# Altium project Ctrlboard.PrjPCB
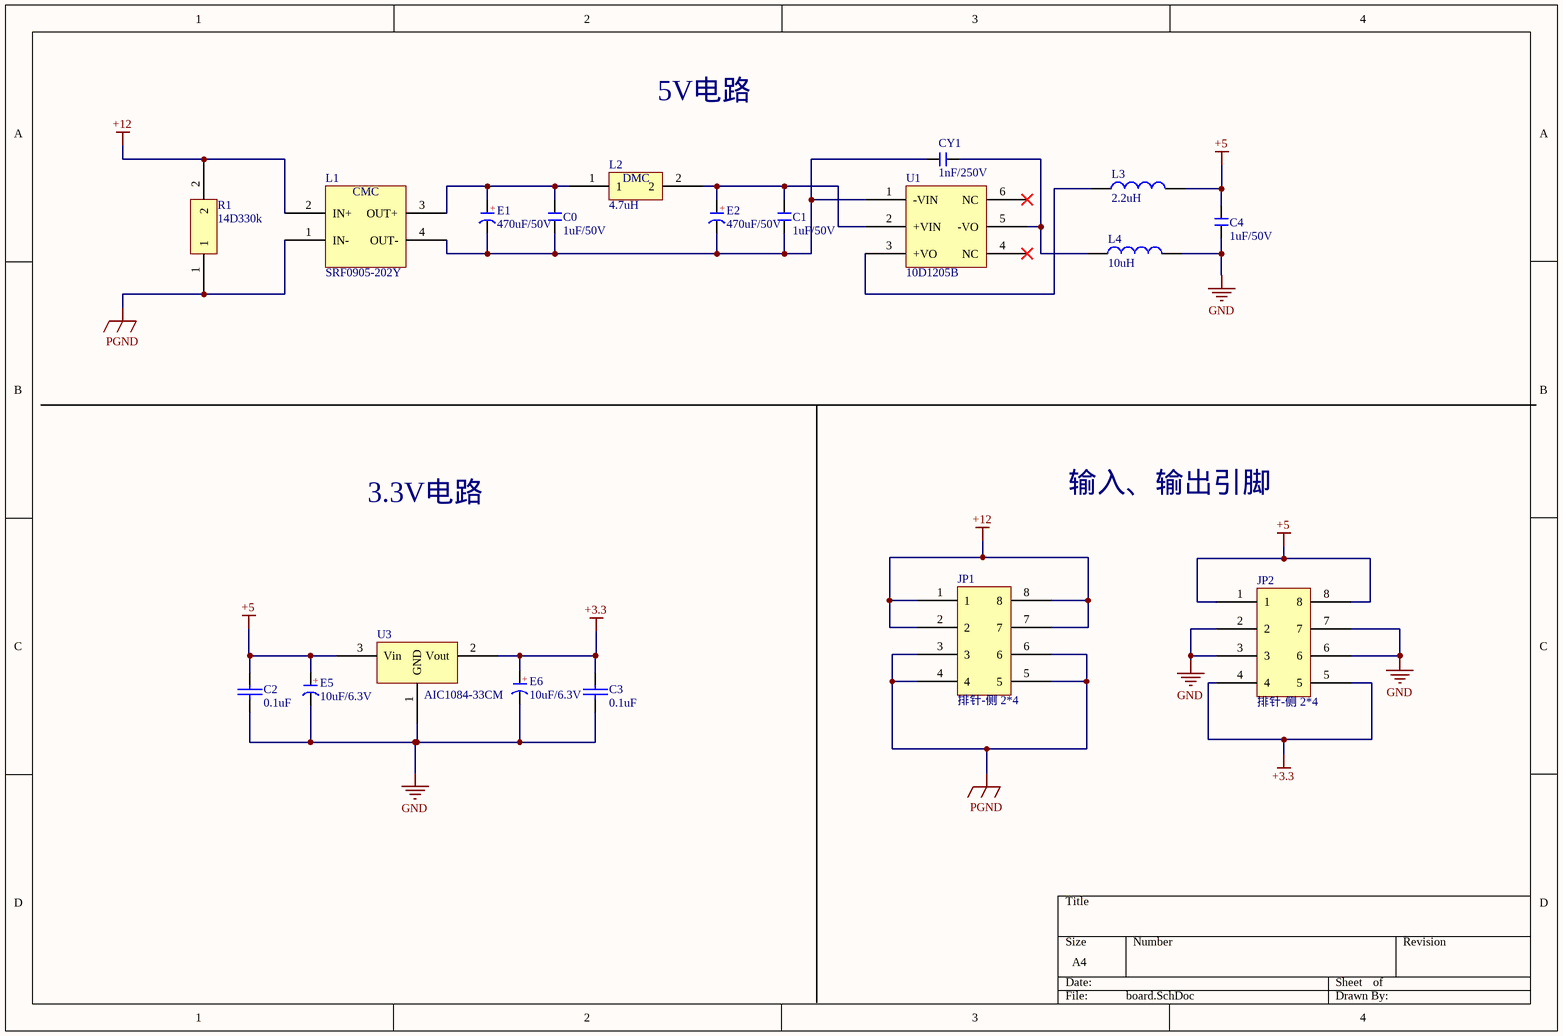
[diagram p0: board.SchDoc]
1 sheet, 19 parts. Net scope: global (net labels, ports and power ports of the same name join across sheets).
Board file: s_pboard2.PcbDoc

## Sheet board.SchDoc
size A4

### Parts
C0  1uF/50V  [CC 2.2*5]
C1  1uF/50V  [CC 2.2*5]
C2  0.1uF  [0603C]
C3  0.1uF  [0603C]
C4  1uF/50V  [CC 2.2*5]
CY1  1nF/250V  [CY 7.5*10*4]
E1  470uF/50V  [CM G(12.5*13.5)]
E2  470uF/50V  [CM G(12.5*13.5)]
E5  10uF/6.3V  [CD A(3216)]
E6  10uF/6.3V  [CD A(3216)]
JP1  排针-侧 2*4  [排针-侧 2*4]
JP2  排针-侧 2*4  [排针-侧 2*4]
L1  SRF0905-202Y  [SRF0905]
L2  4.7uH  [NR5020]
L3  2.2uH  [L 0805]
L4  10uH  [L 0805]
R1  14D330k  [14D330k]
U1  10D1205B  [10D1205B]
U3  AIC1084-33CM  [TO263-3B]

### Nets
+3.3: C3.1 E6.1(A) JP2.4 JP2.5 U3.2(Vout)
+5: C2.2 C4.1 E5.1(A) JP2.1 JP2.8 L3.2 U3.3(Vin)
+12: JP1.1 JP1.2 JP1.7 JP1.8 L1.2(IN+) R1.2
GND: C2.1 C3.2 C4.2 E5.2(K) E6.2(K) JP2.2 JP2.3 JP2.6 JP2.7 L4.2 U3.1(GND)
PGND: JP1.3 JP1.4 JP1.5 JP1.6 L1.1(IN-) R1.1
NetC0_1: C0.1 E1.1(A) L1.3(OUT+) L2.1
NetC0_2: C0.2 C1.2 CY1.1 E1.2(K) E2.2(K) L1.4(OUT-) U1.1(-VIN)
NetC1_1: C1.1 E2.1(A) L2.2 U1.2(+VIN)
NetCY1_2: CY1.2 L4.1 U1.5(-VO)
NetL3_1: L3.1 U1.3(+VO)

Not connected (* = marked no-connect by the designer): U1 4(NC)* 6(NC)*

### Notes on the sheet
- 5V电路
- 3.3V电路
- 输入、输出引脚
- (in symbol C-CD) +
- (in symbol C-CM) +
- (in symbol DML-5020) DMC
- (in symbol SRF0905-202Y) CMC

### Library data of the parts
C0 C1 C4 = C-CC: 直插瓷片电容; 版权归属: 源创客; BOM名称: 直插瓷片电容; 学习资源: www.ooocke.com
C2 C3 = CAP: 无极性电容
CY1 = C-CY: 高压陶瓷电容，Y电容; 版权归属: 源创客; BOM名称: 高压陶瓷电容，Y电容; 学习资源: www.ooocke.com
E1 E2 = C-CM: 贴片电解电容; 版权归属: 源创客; BOM名称: 贴片电解电容; 学习资源: www.ooocke.com
E5 E6 = C-CD: 贴片钽电容; 版权归属: 源创客; BOM名称: 贴片钽电容; 学习资源: www.ooocke.com
L1 = SRF0905-202Y: 共模电感
L2 = DML-5020: 差模电感
L3 L4 = L: 小功率贴片电感; 版权归属: 源创客; BOM名称: 小功率贴片电感; 学习资源: www.ooocke.com